# Altium project PA-HF_100W-VHF_60W.PrjPcb (part 1 of 2)
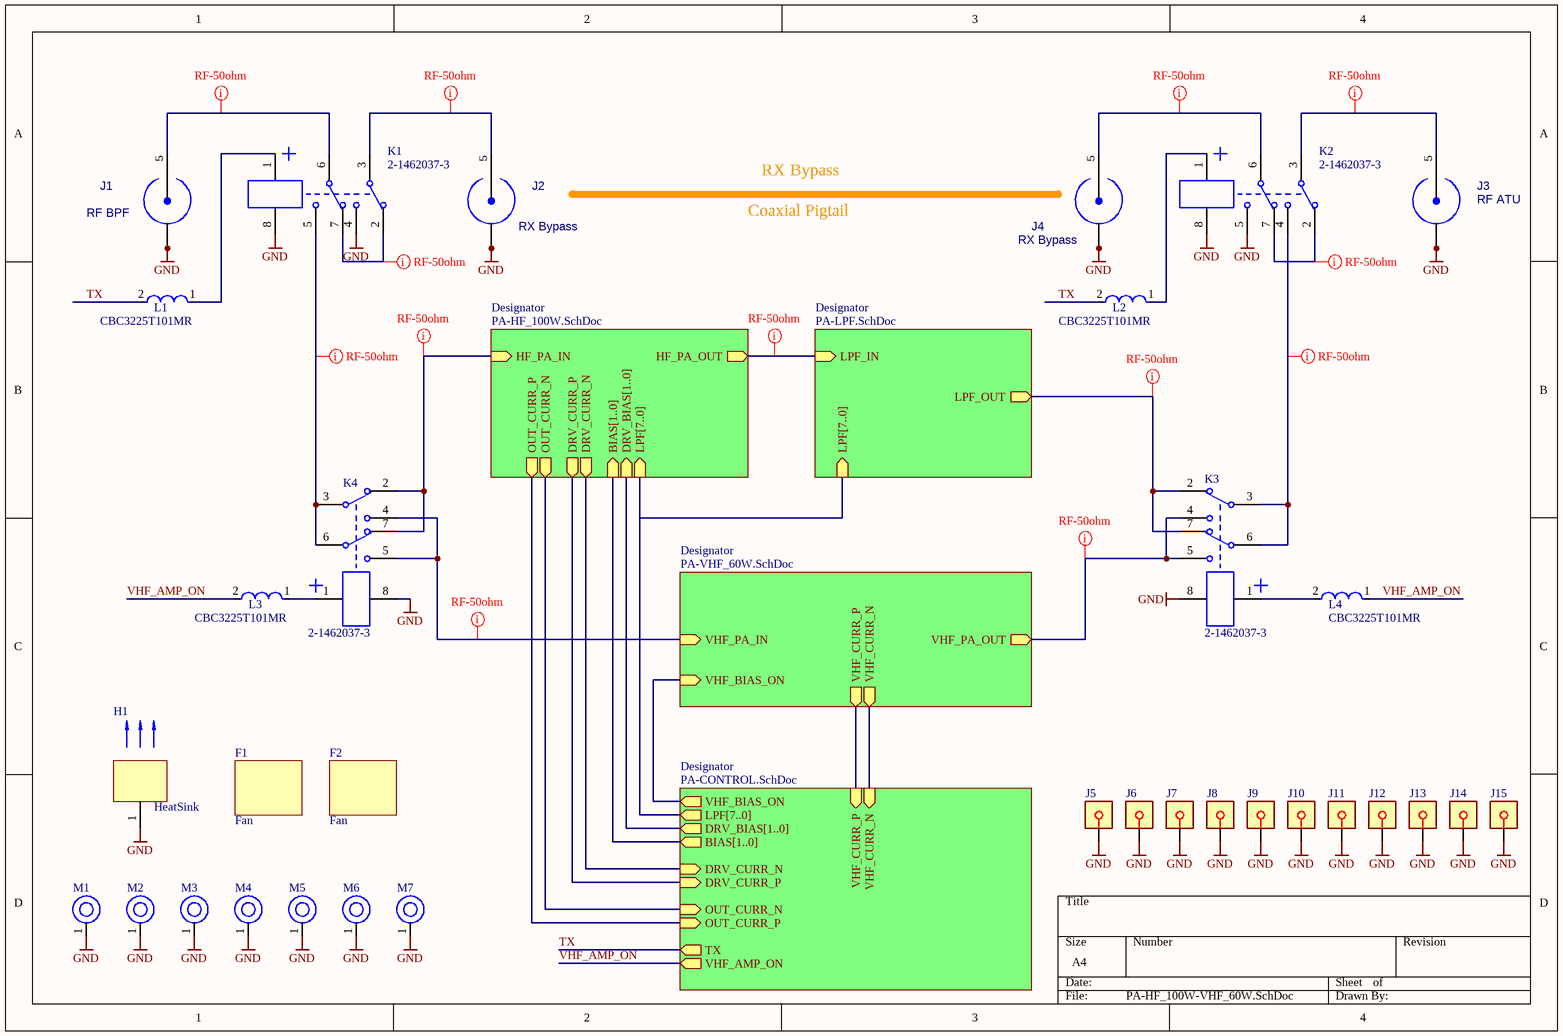
[diagram p0: PA-HF_100W-VHF_60W.SchDoc]
5 sheets, 427 parts. Net scope: hierarchical (ports join the sheet entries above them; power ports are global).
Board file: PA-HF_100W-VHF_60W.PcbDoc
Sheets:
  PA-HF_100W-VHF_60W.SchDoc
    Designator = PA-CONTROL.SchDoc
    Designator = PA-HF_100W.SchDoc
    Designator = PA-LPF.SchDoc
    Designator = PA-VHF_60W.SchDoc

## Sheet PA-HF_100W-VHF_60W.SchDoc
size A4; SheetNumber: 1; SheetTotal: 5

### Parts
F1  Fan  [Fan_60x60x25mm]
F2  Fan  [Fan_60x60x25mm]
H1  HeatSink  [HEATSINK_145x140x35]
J1  RF BPF  [31-5431]
J2  RX Bypass  [31-5431]
J3  RF ATU  [31-5431]
J4  RX Bypass  [31-5431]
J5  SMT RFI Shield Clip  [SMT RFI Shield Clip]  (value not drawn)
J6  SMT RFI Shield Clip  [SMT RFI Shield Clip]  (value not drawn)
J7  SMT RFI Shield Clip  [SMT RFI Shield Clip]  (value not drawn)
J8  SMT RFI Shield Clip  [SMT RFI Shield Clip]  (value not drawn)
J9  SMT RFI Shield Clip  [SMT RFI Shield Clip]  (value not drawn)
J10  SMT RFI Shield Clip  [SMT RFI Shield Clip]  (value not drawn)
J11  SMT RFI Shield Clip  [SMT RFI Shield Clip]  (value not drawn)
J12  SMT RFI Shield Clip  [SMT RFI Shield Clip]  (value not drawn)
J13  SMT RFI Shield Clip  [SMT RFI Shield Clip]  (value not drawn)
J14  SMT RFI Shield Clip  [SMT RFI Shield Clip]  (value not drawn)
J15  SMT RFI Shield Clip  [SMT RFI Shield Clip]  (value not drawn)
K1  2-1462037-3  [TECO-2-1462037-3_V]
K2  2-1462037-3  [TECO-2-1462037-3_V]
K3  2-1462037-3  [TECO-2-1462037-3_V]
K4  2-1462037-3  [TECO-2-1462037-3_V]
L1  CBC3225T101MR  [FP-CB3225-MFG]
L2  CBC3225T101MR  [FP-CB3225-MFG]
L3  CBC3225T101MR  [FP-CB3225-MFG]
L4  CBC3225T101MR  [FP-CB3225-MFG]
M1  MountHole  [MountHole]  (value not drawn)
M2  MountHole  [MountHole]  (value not drawn)
M3  MountHole  [MountHole]  (value not drawn)
M4  MountHole  [MountHole]  (value not drawn)
M5  MountHole  [MountHole]  (value not drawn)
M6  MountHole  [MountHole]  (value not drawn)
M7  MountHole  [MountHole]  (value not drawn)

### Sub-sheets
Designator = PA-CONTROL.SchDoc: LPF[7..0] (out), DRV_BIAS[1..0] (out), BIAS[1..0] (out), DRV_CURR_N (in), DRV_CURR_P (in), OUT_CURR_N (in), OUT_CURR_P (in), VHF_BIAS_ON (out), TX (out), VHF_AMP_ON (out), VHF_CURR_P (in), VHF_CURR_N (in)
Designator = PA-HF_100W.SchDoc: HF_PA_IN (in), HF_PA_OUT (out), DRV_BIAS[1..0] (in), BIAS[1..0] (in), DRV_CURR_N (out), DRV_CURR_P (out), OUT_CURR_N (out), OUT_CURR_P (out), LPF[7..0] (in)
Designator = PA-LPF.SchDoc: LPF_OUT (out), LPF_IN (in), LPF[7..0] (in)
Designator = PA-VHF_60W.SchDoc: VHF_PA_IN (in), VHF_PA_OUT (out), VHF_BIAS_ON (in), VHF_CURR_P (out), VHF_CURR_N (out)

### Nets
GND: H1.1 J1.1(GND) J1.2(GND) J1.3(GND) J1.4(GND) J2.1(GND) J2.2(GND) J2.3(GND) J2.4(GND) J3.1(GND) J3.2(GND) J3.3(GND) J3.4(GND) J4.1(GND) J4.2(GND) J4.3(GND) J4.4(GND) J5.1 J6.1 J7.1 J8.1 J9.1 J10.1 J11.1 J12.1 J13.1 J14.1 J15.1 K1.4 K1.8 K2.5 K2.8 K3.8 K4.8 M1.1 M2.1 M3.1 M4.1 M5.1 M6.1 M7.1
DRV_CURR_N: sheet Designator/DRV_CURR_N, sheet Designator/DRV_CURR_N
DRV_CURR_P: sheet Designator/DRV_CURR_P, sheet Designator/DRV_CURR_P
OUT_CURR_N: sheet Designator/OUT_CURR_N, sheet Designator/OUT_CURR_N
OUT_CURR_P: sheet Designator/OUT_CURR_P, sheet Designator/OUT_CURR_P
TX: L1.2 L2.2 ; sheet Designator/TX
VHF_AMP_ON: L3.2 L4.1 ; sheet Designator/VHF_AMP_ON
VHF_BIAS_ON: sheet Designator/VHF_BIAS_ON, sheet Designator/VHF_BIAS_ON
VHF_CURR_N: sheet Designator/VHF_CURR_N, sheet Designator/VHF_CURR_N
VHF_CURR_P: sheet Designator/VHF_CURR_P, sheet Designator/VHF_CURR_P
NetJ1_5: J1.5(CON) K1.6
NetJ2_5: J2.5(CON) K1.3
NetJ3_5: J3.5(CON) K2.3
NetJ4_5: J4.5(CON) K2.6
NetK1_1: K1.1 L1.1
NetK1_2: K1.2 K1.7
NetK1_5: K1.5 K4.3 K4.6
NetK2_1: K2.1 L2.1
NetK2_2: K2.2 K2.7
NetK2_4: K2.4 K3.3 K3.6
NetK3_1: K3.1 L4.2
NetK3_2: K3.2 K3.7 ; sheet Designator/LPF_OUT
NetK3_4: K3.4 K3.5 ; sheet Designator/VHF_PA_OUT
NetK4_1: K4.1 L3.1
NetK4_2: K4.2 K4.7 ; sheet Designator/HF_PA_IN
NetK4_4: K4.4 K4.5 ; sheet Designator/VHF_PA_IN
NetK6_4: sheet Designator/HF_PA_OUT, sheet Designator/LPF_IN

### Layout directives
rule Width Constraint [Pref Impedance = 50,00ohms    Min Impedance = 50,00ohms    Max Impedance = 50,00ohms]: NetJ1_5, NetJ2_5, NetJ3_5, NetJ4_5, NetK1_2, NetK1_5, NetK2_2, NetK2_4, NetK3_2, NetK3_4, NetK4_2, NetK4_4, NetK6_4

### Notes on the sheet
- RX Bypass
- Coaxial Pigtail

### Library data of the parts
J1-J4 = 31-5431: SMA
K1-K4 = CMP-2000-05409-1: Signal Relay, 2 A, 12 VDC, -40 to 85 degC, 8-Pin SMD, RoHS, Tape and Reel; Manufacturer: TE Connectivity; Coil Suppression Diode: No; Contact Arrangement: DPDT; Product Length (mm): 10mm; Product Height (mm): 5.65mm; Coil Voltage DC: 12V; Pick-up Voltage (Max): 9VDC; Coil Resistance: 1.029kohm; Voltage Rating (VDC): 220; Dropout Volt: 1.2VDC; Operate Time: 1ms; Contact Current Rating: 2A; Relay Construction: Non-Latching; Seal: Unsealed; Maximum Power Rating: 60W/62.5VA; Product Depth (mm): 7.5mm; Coil Current: 11.67mA; Voltage Rating (VAC): 250V; Contact Form: 2FormC; Contact Material: PalladiumRuthenium/Gold; Pin Count: 8; LED Indicator: No; Operating Temp Range: -40Cto85C; Push To Test Button: No; Mounting Style: SurfaceMount; Type: SignalRelay; Packaging: TapeandReel; Datasheet Version: Rev. 0116, 01/2016; Manufacturer URL: http://www.te.com/; Datasheet URL: http://www.te.com/commerce/DocumentDelivery/DDEController?Action=srchrtrv&DocNm=108-98001&DocType=SS&DocLang=EN; Termination Style: GullWing
L1-L4 = CMP-14484-000373-1: SMD Inductors 100uH ±20% 0.34A 1.82Ω 1210; Resistance: 1.4R; DC Current: 340mA; DC Resistance (DCR): 1.82R; Saturation Current: 270mA; Self Resonant Frequency: 6MHz; Core Material: Ferrite; Inductor Type: POWER; Shielding: Unshielded; Test Frequency: 100kHz; Max Operating Temperature: 105°C; Length: 0.126inch; Inductance: 100uH; Current Rating: 340mA; Resistor Type: Wirewound; Halogen Free: Halogen Free; Height - Seated (Max): 0.106inch; Case/Package: 1210; Package Quantity: 1000; Lead Free: Lead Free; Series: CB; Tolerance: 20%; Depth: 2.7mm; Number of Pins: 2; Width: 0.098inch; Termination: SMD/SMT; Min Operating Temperature: -40°C; Max DC Current: 340mA; Inductance Tolerance: 20%; Radiation Hardening: No; Military Standard: Not; Height: 2.5mm; Case Code (Metric): 3225; Packaging: Tape and Reel; Mount: Surface Mount; RoHS Compliant: Yes; Case Code (Imperial): 1210

## Sheet PA-CONTROL.SchDoc
size A3; SheetNumber: 5; SheetTotal: 5
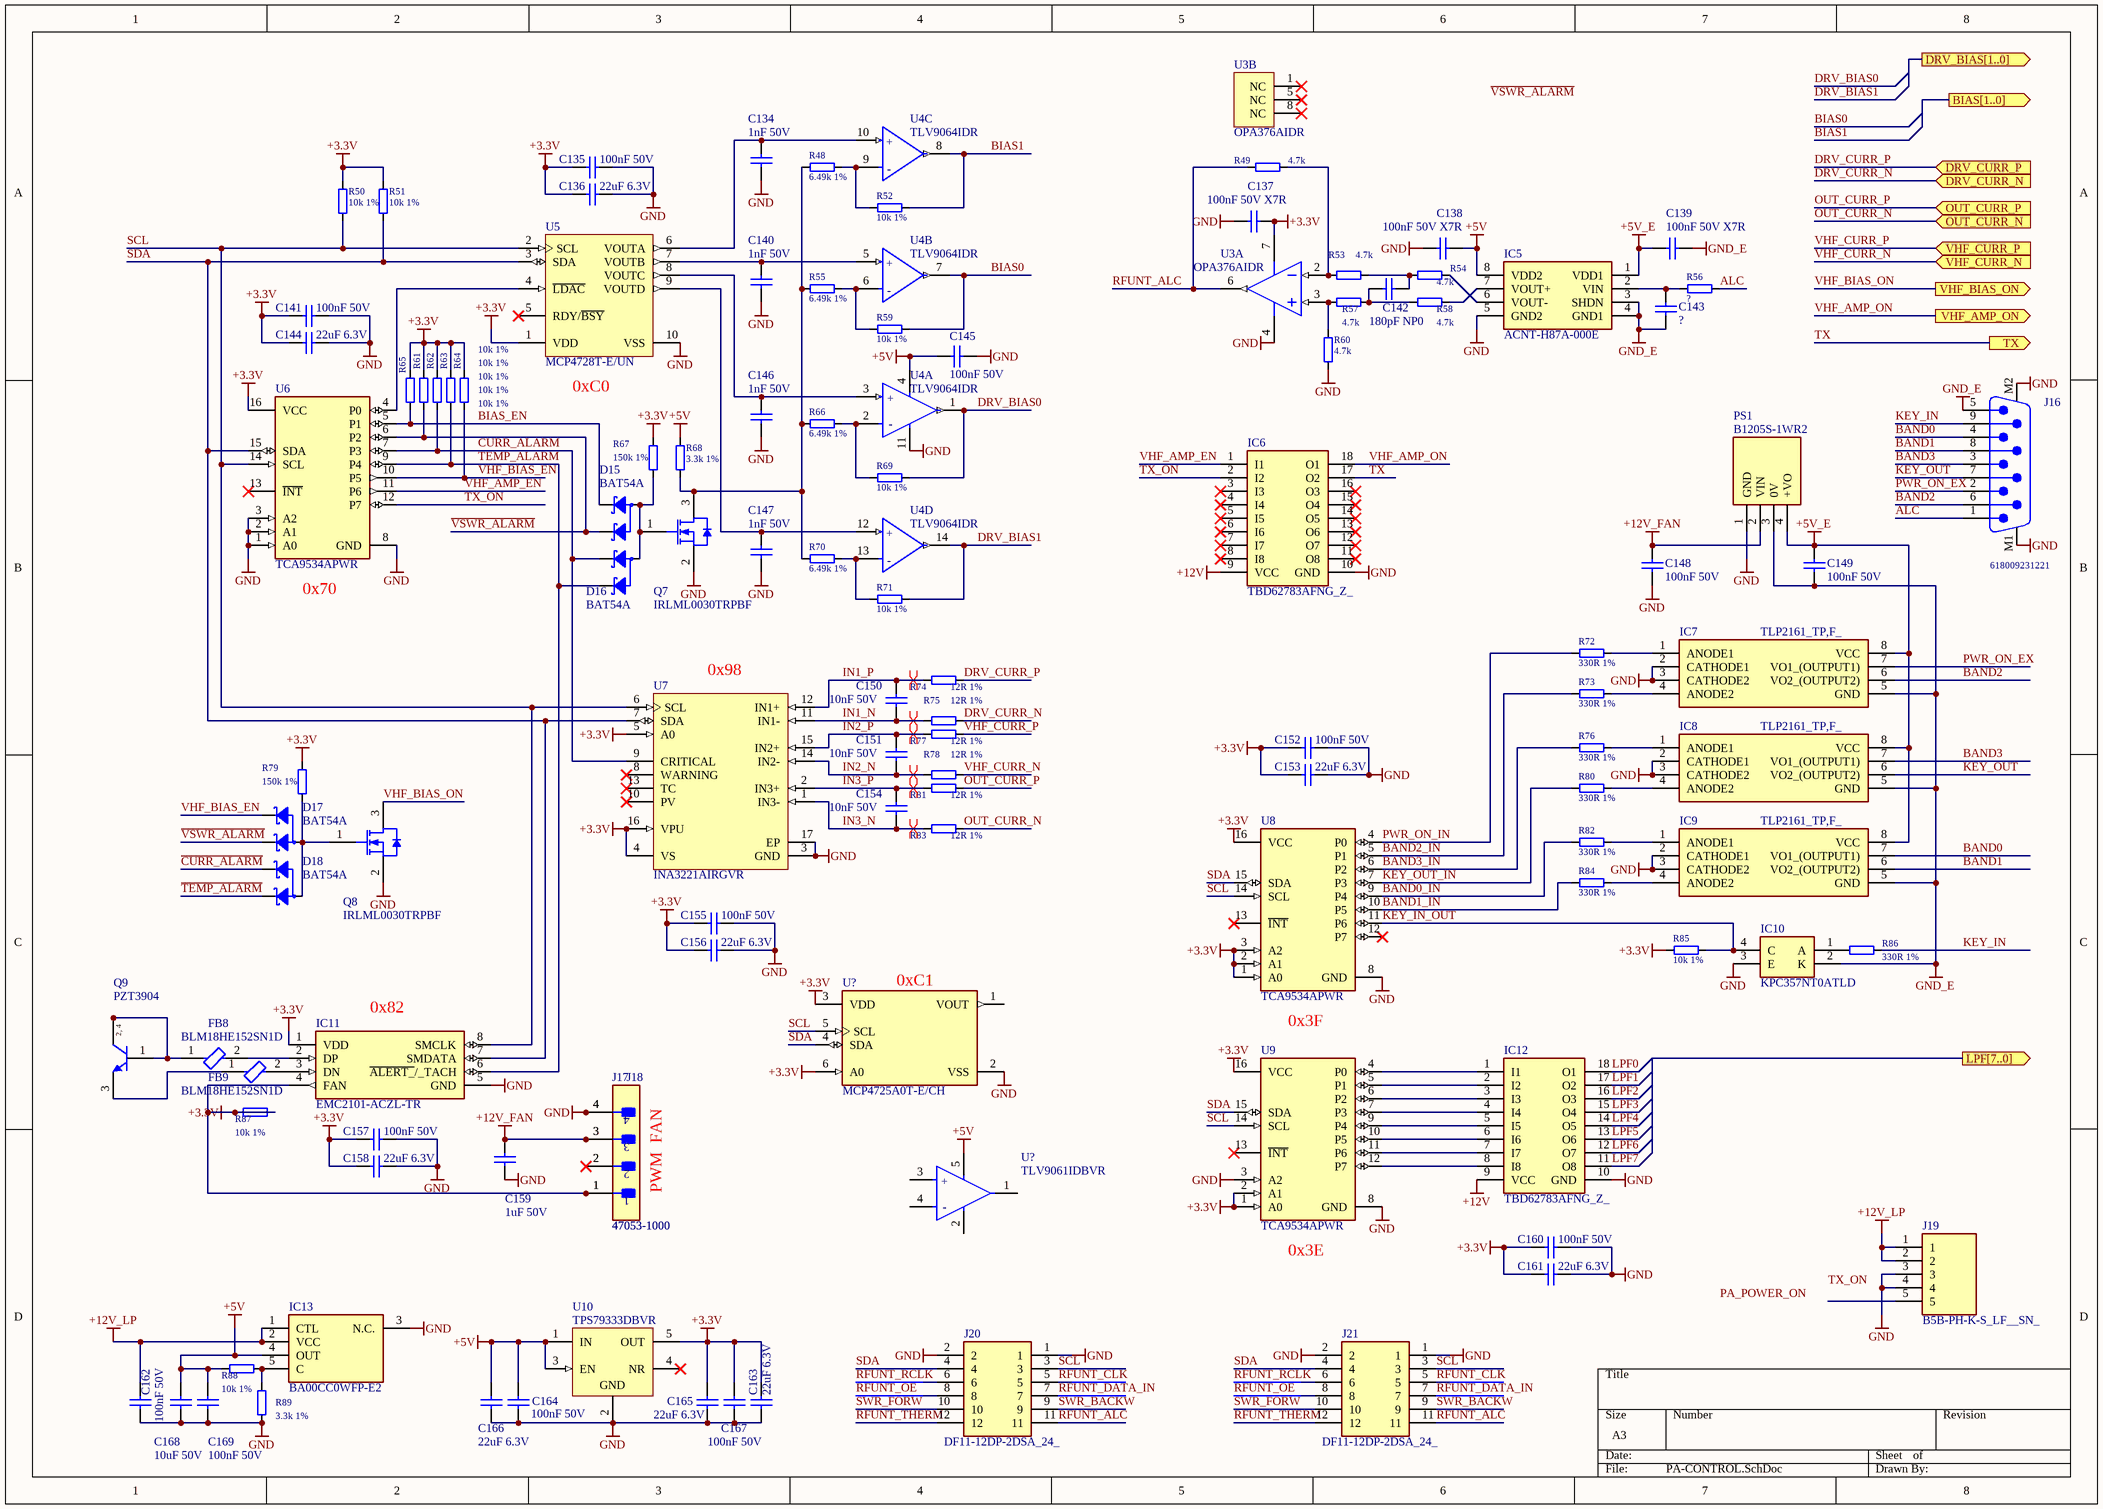
[diagram p1: PA-CONTROL.SchDoc]

### Parts
(Parts that share a designator on the sheet are numbered #1, #2 ... from top to bottom, then left to right.)
C134  1nF 50V  [C-0805]
C135  100nF 50V  [C-0805]
C136  22uF 6.3V  [C-0805]
C137  100nF 50V X7R  [C-0805]
C138  100nF 50V X7R  [C-0805]
C139  100nF 50V X7R  [C-0805]
C140  1nF 50V  [C-0805]
C141  100nF 50V  [C-0805]
C142  180pF NP0  [C-0805]
C143  ?  [C-0805]
C144  22uF 6.3V  [C-0805]
C145  100nF 50V  [C-0805]
C146  1nF 50V  [C-0805]
C147  1nF 50V  [C-0805]
C148  100nF 50V  [C-0805]
C149  100nF 50V  [C-0805]
C150  10nF 50V  [C-0805]
C151  10nF 50V  [C-0805]
C152  100nF 50V  [C-0805]
C153  22uF 6.3V  [C-0805]
C154  10nF 50V  [C-0805]
C155  100nF 50V  [C-0805]
C156  22uF 6.3V  [C-0805]
C157  100nF 50V  [C-0805]
C158  22uF 6.3V  [C-0805]
C159  1uF 50V  [C-0805]
C160  100nF 50V  [C-0805]
C161  22uF 6.3V  [C-0805]
C162  100nF 50V  [C-0805]
C163  22uF 6.3V  [C-0805]
C164  100nF 50V  [C-0805]
C165  22uF 6.3V  [C-0805]
C166  22uF 6.3V  [C-0805]
C167  100nF 50V  [C-0805]
C168  10uF 50V  [C-0805]
C169  100nF 50V  [C-0805]
D15  BAT54A  [SOT-23]
D16  BAT54A  [SOT-23]
D17  BAT54A  [SOT-23]
D18  BAT54A  [SOT-23]
FB8  BLM18HE152SN1D  [FP-BLM18-0_15-t0_8-IPC_C]
FB9  BLM18HE152SN1D  [FP-BLM18-0_15-t0_8-IPC_C]
IC5  ACNT-H87A-000E  [SOIC127P1661X403-8N]
IC6  TBD62783AFNG_Z_  [SOP65P640X155-18N]
IC7  TLP2161_TP,F_  [SOIC127P600X290-8N]
IC8  TLP2161_TP,F_  [SOIC127P600X290-8N]
IC9  TLP2161_TP,F_  [SOIC127P600X290-8N]
IC10  KPC357NT0ATLD  [KPC357NT0ATLD]
IC11  EMC2101-ACZL-TR  [SOP65P490X110-8N]
IC12  TBD62783AFNG_Z_  [SOP65P640X155-18N]
IC13  BA00CC0WFP-E2  [BA00CC0WFPE2]
J16  618009231221  [618009231221]
J17  47053-1000  [FP-47053-1000-MFG]
J18  47053-1000  [FP-47053-1000-MFG]
J19  B5B-PH-K-S_LF__SN_  [SHDR5W50P0X200_1X5_1190X450X600P]
J20  DF11-12DP-2DSA_24_  [SHDR12W60P200_2X6_1400X500X690P]
J21  DF11-12DP-2DSA_24_  [SHDR12W60P200_2X6_1400X500X690P]
PS1  B1205S-1WR2  [B1205S1WR2]
Q7  IRLML0030TRPBF  [INTR-SOT-23-3_V]
Q8  IRLML0030TRPBF  [INTR-SOT-23-3_V]
Q9  PZT3904  [FAIR-SOT223-4_V]
R48  6.49k 1%  [R-0805]
R49  4.7k  [R-0805]
R50  10k 1%  [R-0805]
R51  10k 1%  [R-0805]
R52  10k 1%  [R-0805]
R53  4.7k  [R-0805]
R54  4.7k  [R-0805]
R55  6.49k 1%  [R-0805]
R56  ?  [R-0805]
R57  4.7k  [R-0805]
R58  4.7k  [R-0805]
R59  10k 1%  [R-0805]
R60  4.7k  [R-0805]
R61  10k 1%  [R-0805]
R62  10k 1%  [R-0805]
R63  10k 1%  [R-0805]
R64  10k 1%  [R-0805]
R65  10k 1%  [R-0805]
R66  6.49k 1%  [R-0805]
R67  150k 1%  [R-0805]
R68  3.3k 1%  [R-0805]
R69  10k 1%  [R-0805]
R70  6.49k 1%  [R-0805]
R71  10k 1%  [R-0805]
R72  330R 1%  [R-0805]
R73  330R 1%  [R-0805]
R74  12R 1%  [R-0805]
R75  12R 1%  [R-0805]
R76  330R 1%  [R-0805]
R77  12R 1%  [R-0805]
R78  12R 1%  [R-0805]
R79  150k 1%  [R-0805]
R80  330R 1%  [R-0805]
R81  12R 1%  [R-0805]
R82  330R 1%  [R-0805]
R83  12R 1%  [R-0805]
R84  330R 1%  [R-0805]
R85  10k 1%  [R-0805]
R86  330R 1%  [R-0805]
R87  10k 1%  [R-0805]
R88  10k 1%  [R-0805]
R89  3.3k 1%  [R-0805]
U3  OPA376AIDR  [D0008A_N]  (parts A,B of 2)
U4  TLV9064IDR  [FP-D0014A-MFG]  (parts A,B,C,D of 4)
U5  MCP4728T-E/UN  [MSOP-UN10_L]
U6  TCA9534APWR  [FP-PW0016A-MFG]
U7  INA3221AIRGVR  [RGV0016A_V]
U8  TCA9534APWR  [FP-PW0016A-MFG]
U9  TCA9534APWR  [FP-PW0016A-MFG]
U10  TPS79333DBVR  [DBV0005A_L]
U?#1  MCP4725A0T-E/CH  [FP-C04-028-CHY-MFG]
U?#2  TLV9061IDBVR  [FP-DBV0005A-MFG]

### Ports
BIAS[1..0] (out), DRV_BIAS[1..0] (out), DRV_CURR_N (in), DRV_CURR_P (in), LPF[7..0] (out), OUT_CURR_N (in), OUT_CURR_P (in), TX (out), VHF_AMP_ON (out), VHF_BIAS_ON (out), VHF_CURR_N (in), VHF_CURR_P (in)

### Nets
+3.3V: C135.2 C136.2 C137.2 C141.2 C144.2 C152.2 C153.2 C155.2 C156.2 C157.2 C158.2 C160.2 C161.2 C163.2 C165.2 C167.2 IC11.1(VDD) IC11.4(FAN) J17.1 J18.1 R50.1 R51.1 R61.1 R62.1 R63.1 R64.1 R65.1 R67.1 R79.1 R85.2 R87.1 R87.2 U3.7(V+) U5.1(VDD) U6.16(VCC) U7.4(VS) U7.5(A0) U7.16(VPU) U8.1(A0) U8.2(A1) U8.3(A2) U8.16(VCC) U9.1(A0) U9.2(A1) U9.16(VCC) U10.5(OUT) U?#1.3(VDD) U?#1.6(A0)
+5V: C138.2 C145.2 C164.2 C166.2 C168.2 C169.2 IC5.8(VDD2) IC13.4(OUT) R68.1 R88.2 U4.4(V+) U10.1(IN) U10.3(EN) U?#2.5(V+)
+5V_E: C139.1 C149.1 IC5.1(VDD1) IC7.8(VCC) IC8.8(VCC) IC9.8(VCC) PS1.4(+VO)
+12V: IC6.9(VCC) IC12.9(VCC)
+12V_FAN: C148.1 C159.2 J17.3 J18.3 PS1.2(VIN)
+12V_LP: C162.2 IC13.1(CTL) IC13.2(VCC) J19.1 J19.2
GND: C134.1 C135.1 C136.1 C137.1 C138.1 C140.1 C141.1 C144.1 C145.1 C146.1 C147.1 C148.2 C152.1 C153.1 C155.1 C156.1 C157.1 C158.1 C159.1 C160.1 C161.1 C162.1 C163.1 C164.1 C165.1 C166.1 C167.1 C168.1 C169.1 IC5.5(GND2) IC6.10(GND) IC7.2(CATHODE1) IC7.3(CATHODE2) IC8.2(CATHODE1) IC8.3(CATHODE2) IC9.2(CATHODE1) IC9.3(CATHODE2) IC10.3(E) IC11.5(GND) IC12.10(GND) IC13.3(N.C.) J16.M1 J16.M2 J17.4 J18.4 J19.3 J19.4 J20.1 J20.2 J21.1 J21.2 PS1.1(GND) Q7.2(S) Q8.2(S) R60.2 R89.2 U3.4(V-) U4.11(V-) U5.10(VSS) U6.1(A0) U6.2(A1) U6.3(A2) U6.8(GND) U7.3(GND) U7.17(EP) U8.8(GND) U9.3(A2) U9.8(GND) U10.2(GND) U?#1.2(VSS)
GND_E: C139.2 C143.2 C149.2 IC5.3(SHDN) IC5.4(GND1) IC7.5(GND) IC8.5(GND) IC9.5(GND) IC10.2(K) J16.5 PS1.3(0V)
ALC: J16.1 R56.1
BAND0: IC9.7(VO1_(OUTPUT1)) J16.4
BAND0_IN: R82.2 U8.9(P4)
BAND1: IC9.6(VO2_(OUTPUT2)) J16.8
BAND1_IN: R84.2 U8.10(P5)
BAND2: IC7.6(VO2_(OUTPUT2)) J16.6
BAND2_IN: R73.2 U8.5(P1)
BAND3: IC8.7(VO1_(OUTPUT1)) J16.3
BAND3_IN: R76.2 U8.6(P2)
BIAS0: R59.1 U4.7(OUT2)
BIAS1: R52.1 U4.8(OUT3)
BIAS_EN: D15.1 R65.2 U6.5(P1)
~{CURR_ALARM}: D16.1 D18.2 R62.2 U6.7(P3) U7.9(CRITICAL)
DRV_BIAS0: R69.1 U4.1(OUT1)
DRV_BIAS1: R71.1 U4.14(OUT4)
DRV_CURR_N: R75.1 ; port DRV_CURR_N
DRV_CURR_P: R74.1 ; port DRV_CURR_P
IN1_N: C150.1 R75.2 U7.11(IN1-)
IN1_P: C150.2 R74.2 U7.12(IN1+)
IN2_N: C151.1 R78.2 U7.14(IN2-)
IN2_P: C151.2 R77.2 U7.15(IN2+)
IN3_N: C154.1 R83.2 U7.1(IN3-)
IN3_P: C154.2 R81.2 U7.2(IN3+)
KEY_IN: J16.9 R86.1
KEY_IN_OUT: IC10.4(C) R85.1 U8.11(P6)
KEY_OUT: IC8.6(VO2_(OUTPUT2)) J16.7
KEY_OUT_IN: R80.2 U8.7(P3)
LPF0: IC12.18(O1)
LPF1: IC12.17(O2)
LPF2: IC12.16(O3)
LPF3: IC12.15(O4)
LPF4: IC12.14(O5)
LPF5: IC12.13(O6)
LPF6: IC12.12(O7)
LPF7: IC12.11(O8)
OUT_CURR_N: R83.1 ; port OUT_CURR_N
OUT_CURR_P: R81.1 ; port OUT_CURR_P
PWR_ON_EX: IC7.7(VO1_(OUTPUT1)) J16.2
PWR_ON_IN: R72.2 U8.4(P0)
RFUNT_ALC: J20.11 J21.11 R49.2 U3.6(OUT)
RFUNT_CLK: J20.5 J21.5
RFUNT_DATA_IN: J20.7 J21.7
RFUNT_OE: J20.8 J21.8
RFUNT_RCLK: J20.6 J21.6
RFUNT_THERM: J20.12 J21.12
SCL: IC11.8(SMCLK) J20.3 J21.3 R50.2 U5.2(SCL) U6.14(SCL) U7.6(SCL) U8.14(SCL) U9.14(SCL) U?#1.5(SCL)
SDA: IC11.7(SMDATA) J20.4 J21.4 R51.2 U5.3(SDA) U6.15(SDA) U7.7(SDA) U8.15(SDA) U9.15(SDA) U?#1.4(SDA)
SWR_BACKW: J20.9 J21.9
SWR_FORW: J20.10 J21.10
~{TEMP_ALARM}: D16.2 D18.1 IC11.6(~{ALERT_}/_TACH) R63.2 U6.9(P4)
TX: IC6.17(O2) ; port TX
TX_ON: IC6.2(I2) U6.12(P7)
~{VSWR_ALARM}: D15.2 D17.1 R61.2 U6.6(P2)
VHF_AMP_EN: IC6.1(I1) U6.11(P6)
VHF_AMP_ON: IC6.18(O1) ; port VHF_AMP_ON
VHF_BIAS_EN: D17.2 R64.2 U6.10(P5)
VHF_BIAS_ON: Q8.3(D) ; port VHF_BIAS_ON
VHF_CURR_N: R78.1 ; port VHF_CURR_N
VHF_CURR_P: R77.1 ; port VHF_CURR_P
NetC134_2: C134.2 U4.10(IN3+) U5.6(VOUTA)
NetC140_2: C140.2 U4.5(IN2+) U5.7(VOUTB)
NetC142_1: C142.1 R57.1 R58.2
NetC142_2: C142.2 R53.1 R54.2
NetC143_1: C143.1 IC5.2(VIN) R56.2
NetC146_2: C146.2 U4.3(IN1+) U5.8(VOUTC)
NetC147_2: C147.2 U4.12(IN4+) U5.9(VOUTD)
NetD15_3: D15.3 D16.3 Q7.1(G) R67.2
NetD17_3: D17.3 D18.3 Q8.1(G) R79.2
NetFB8_1: FB8.1 Q9.1(B) Q9.2(C) Q9.4(C)
NetFB8_2: FB8.2 IC11.2(DP)
NetFB9_1: FB9.1 Q9.3(E)
NetFB9_2: FB9.2 IC11.3(DN)
NetIC5_6: IC5.6(VOUT-) R54.1
NetIC5_7: IC5.7(VOUT+) R58.1
NetIC7_1: IC7.1(ANODE1) R72.1
NetIC7_4: IC7.4(ANODE2) R73.1
NetIC8_1: IC8.1(ANODE1) R76.1
NetIC8_4: IC8.4(ANODE2) R80.1
NetIC9_1: IC9.1(ANODE1) R82.1
NetIC9_4: IC9.4(ANODE2) R84.1
NetIC10_1: IC10.1(A) R86.2
NetIC12_1: IC12.1(I1) U9.4(P0)
NetIC12_2: IC12.2(I2) U9.5(P1)
NetIC12_3: IC12.3(I3) U9.6(P2)
NetIC12_4: IC12.4(I4) U9.7(P3)
NetIC12_5: IC12.5(I5) U9.9(P4)
NetIC12_6: IC12.6(I6) U9.10(P5)
NetIC12_7: IC12.7(I7) U9.11(P6)
NetIC12_8: IC12.8(I8) U9.12(P7)
NetIC13_5: IC13.5(C) R88.1 R89.1
NetJ17_2: J17.2 J18.2
NetQ7_3: Q7.3(D) R48.2 R55.2 R66.2 R68.2 R70.2
NetR48_1: R48.1 R52.2 U4.9(IN3-)
NetR49_1: R49.1 R53.2 U3.2(IN-)
NetR55_1: R55.1 R59.2 U4.6(IN2-)
NetR57_2: R57.2 R60.1 U3.3(IN+)
NetR66_1: R66.1 R69.2 U4.2(IN1-)
NetR70_1: R70.1 R71.2 U4.13(IN4-)
NetU5_4: U5.4(~{LDAC}) U6.4(P0)

Not connected (* = marked no-connect by the designer): IC6 3(I3)* 4(I4)* 5(I5)* 6(I6)* 7(I7)* 8(I8)* 11(O8)* 12(O7)* 13(O6)* 14(O5)* 15(O4)* 16(O3)*; J19 5; U3 1(NC)* 5(NC)* 8(NC)*; U5 5(RDY/~{BSY})*; U6 13(~{INT})*; U7 8(WARNING)* 10(PV)* 13(TC)*; U8 12(P7)* 13(~{INT})*; U9 13(~{INT})*; U10 4(NR)*; U?#1 1(VOUT); U?#2 1(OUT) 2(V-) 3(IN+) 4(IN-)

### Layout directives
differential pair: IN1_N, IN1_P, IN2_N, IN2_P, IN3_N, IN3_P

### Notes on the sheet
- (near U5) 0xC0
- (near U6) 0x70
- (near U7) 0x98
- (near U?#1) 0xC1
- (near IC11) 0x82
- 0x3F
- PWM  FAN
- (near U9) 0x3E
- Labels drawn without touching a wire or pin: PA_POWER_ON, TX_ON, ~{VSWR_ALARM}
- (in symbol CMP-2000-06916-1) 2, 4
- (in symbol CMP-04895-000189-1, part A) +; -
- (in symbol CMP-04895-000189-1, part B) +; -
- (in symbol CMP-04895-000189-1, part C) +; -
- (in symbol CMP-04895-000189-1, part D) +; -
- (in symbol CMP-04895-000218-1) +; -

### Library data of the parts
C134-C169 = C semi: Ceramic Multilayer Capacitor
FB8 FB9 = CMP-0686-00368-3: Chip Ferrite Bead, 0603, 1500Ω @ 100MHz, 0.5Ω, 25%, 500mA; Impedance: 1.5kR; DC Resistance (DCR): 500mR; Number of Circuits: 1; Test Frequency: 100MHz; Case/Package: 0603; Max Operating Temperature: 125°C; Package Quantity: 1; Max DC Current: 500mA; Tolerance: 25%; Core Material: Ferrite; Width: 0.8mm; Number of Pins: 2; Depth: 0.8mm; Radiation Hardening: No; Case Code (Imperial): 0603; Min Operating Temperature: -55°C; Termination: SMD/SMT; Material: Ferrite; Military Standard: Not; Number of Lines: 1; DC Current: 500mA; Length: 1.6mm; REACH SVHC: No SVHC; Lead Free: Lead Free; Current Rating: 500mA; Max Current Rating: 500mA; Packaging: Tape and Reel; Case Code (Metric): 1608; Height: 0.8mm
IC5 = ACNT-H87A-000E: Integrated Circuit; Manufacturer_Name: Avago Technologies; Datasheet Link: https://4donline.ihs.com/images/VipMasterIC/IC/AVGO/AVGO-S-A0003550281/AVGO-S-A0003550281-1.pdf?hkey=52A5661711E402568146F3353EA87419; Height: 4.034mm; Manufacturer_Part_Number: ACNT-H87A-000E; Mouser Part Number: 630-ACNT-H87A-000E; Mouser Price/Stock: https://www.mouser.co.uk/ProductDetail/Broadcom-Avago/ACNT-H87A-000E?qs=BZBei1rCqCBJ1okFPm4nfQ%3D%3D
IC6 IC12 = TBD62783AFNG_Z_: Integrated Circuit; Manufacturer_Name: Toshiba; Manufacturer_Part_Number: TBD62783AFNG(Z); Datasheet Link: https://toshiba.semicon-storage.com/info/docget.jsp?did=30523; Height: 1.55mm
IC7-IC9 = TLP2160_TP,F_: Integrated Circuit; Manufacturer_Name: Toshiba; Manufacturer_Part_Number: TLP2160(TP,F); Datasheet Link: https://toshiba.semicon-storage.com/info/docget.jsp?did=10044&prodName=TLP2160; Height: 2.9mm; Mouser Part Number: 757-TLP2160TPF; Mouser Price/Stock: https://www.mouser.co.uk/ProductDetail/Toshiba/TLP2160TPF?qs=BybUIy1AcUYH5UC919f%2FeA%3D%3D; Arrow Part Number: TLP2160(TP,F); Arrow Price/Stock: https://www.arrow.com/en/products/tlp2160-tpf/toshiba
IC10 = KPC357NT0ATLD: Integrated Circuit; Manufacturer_Name: Cosmo Electronics; Datasheet Link: https://datasheet.lcsc.com/szlcsc/Cosmo-Electronics-KPC357NT0ATLD_C136410.pdf; Height: 2.7mm; Manufacturer_Part_Number: KPC357NT0ATLD
IC11 = EMC2101-ACZL-TR: Integrated Circuit; Manufacturer_Name: Microchip; Datasheet Link: http://ww1.microchip.com/downloads/en/DeviceDoc/2101.pdf; Height: 1.1mm; Manufacturer_Part_Number: EMC2101-ACZL-TR; Mouser Part Number: 886-EMC2101-ACZL-TR; Mouser Price/Stock: https://www.mouser.co.uk/ProductDetail/Microchip-Technology/EMC2101-ACZL-TR?qs=pA5MXup5wxFIE%2FN8LSbs9g%3D%3D; Arrow Part Number: EMC2101-ACZL-TR; Arrow Price/Stock: https://www.arrow.com/en/products/emc2101-aczl-tr/microchip-technology
IC13 = BA00CC0WFP-E2: Integrated Circuit; Manufacturer_Name: ROHM Semiconductor; Datasheet Link: https://datasheet.datasheetarchive.com/originals/dk/DKDS-10/186347.pdf; Height: 2.5mm; Manufacturer_Part_Number: BA00CC0WFP-E2; Mouser Part Number: 755-BA00CC0WFP-E2; Mouser Price/Stock: https://www.mouser.co.uk/ProductDetail/ROHM-Semiconductor/BA00CC0WFP-E2?qs=4kLU8WoGk0t%2Fg3HZY45H1w%3D%3D; Arrow Part Number: BA00CC0WFP-E2; Arrow Price/Stock: https://www.arrow.com/en/products/ba00cc0wfp-e2/rohm-semiconductor
J16 = CMP-1502-00284-1: Male PCB Connector with Hex Screw WR-DSUB, 8.08 mm, Angled, 9 pins; Manufacturer: Wurth Elektronik; Working Voltage: 125VAC; Contact Resistance: 30mOhm; Rated Current: 3A; Pin Number: 9; Manufacturer URL: http://www.we-online.de; Orientation: Angled; Operating Temperature: -40to85degC; Package Reference: 618009231221; Gender: Male; Mounting Technology: THT; Publisher: WurthElektronik; Datasheet URL: https://katalog.we-online.de/em/datasheet/6180xx231221.pdf; Part Number: 618009231221; Packaging: Tray
J17 J18 = CMP-04776-000290-1: CONN HEADER VERT 4POS 2.54MM; Number of Positions: 4; Voltage Rating (DC): 250V; Gender: Male; Current Rating: 4A; Glow Wire Compliant: Non-compliant; Contact Material: Brass; Contact Plating: Tin; Radiation Hardening: No; Package Quantity: 12000; Packaging: Bulk; Termination: Through Hole; Depth: 5.84mm; Series: 47053; Number of Contacts: 4; Length: 10.2mm; Halogen Free: Low Halogen; Number of Circuits: 4; Max Operating Temperature: 75°C; Housing Color: Beige; Min Operating Temperature: 0°C; Number of Rows: 1; Pitch: 2.54mm; Housing Material: Nylon; Orientation: Vertical; Mount: Through Hole; Voltage Rating: 250V
J19 = B5B-PH-K-S_LF__SN_: Connector; Manufacturer_Name: JST (JAPAN SOLDERLESS TERMINALS); Manufacturer_Part_Number: B5B-PH-K-S(LF)(SN); Datasheet Link: http://uk.rs-online.com/web/p/products/8201438; Height: 6mm; Arrow Part Number: B5B-PH-K-S(LF)(SN); Arrow Price/Stock: https://www.arrow.com/en/products/b5b-ph-k-s-lf-sn/jst-manufacturing
J20 J21 = DF11-12DP-2DSA_24_: Connector; Manufacturer_Name: Hirose; Manufacturer_Part_Number: DF11-12DP-2DSA(24); Datasheet Link: https://datasheet.datasheetarchive.com/originals/distributors/SFDatasheet-7/sf-000141225.pdf; Height: 6.9mm; Mouser Part Number: 798-DF11-12DP-2DSA24; Mouser Price/Stock: https://www.mouser.co.uk/ProductDetail/Hirose-Connector/DF11-12DP-2DSA24?qs=zOgoZG1CgI9hGIQfeQgy6Q%3D%3D; Arrow Part Number: DF11-12DP-2DSA(24); Arrow Price/Stock: https://www.arrow.com/en/products/df11-12dp-2dsa-24/hirose-electric
PS1 = B1205S-1WR2: Power Supply; Manufacturer_Name: Mornsun; Datasheet Link: https://www.mornsun-power.com/public/uploads/pdf/B_D-1WR2.pdf; Height: 10.41mm; Manufacturer_Part_Number: B1205S-1WR2
Q7 Q8 = CMP-2000-06483-1: HEXFET(R) Power MOSFET, 1.3 W, 4.4 ns, -55 to 150 degC, 3-Pin SOT-23, RoHS, Tape and Reel; Manufacturer: International Rectifier; Maximum Drain Source Resistance: 0.027Ω; Transistor Configuration: Single; Channel Mode: Enhancement; Maximum Power Dissipation: 1.3W; Typical Input Capacitance @ Vds: 382pF@15V; Maximum Gate Source Voltage: ±20V; Number of Elements per Chip: 1; Transistor Material: Si; Maximum Gate Threshold Voltage: 2.3V; Typical Turn-On Delay Time: 5.2ns; Maximum Drain Source Voltage: 30V; Typical Turn-Off Delay Time: 7.4ns; Minimum Gate Threshold Voltage: 1.3V; Channel Type: N; Typical Gate Charge @ Vgs: 2.6nC@4.5V; Maximum Continuous Drain Current: 5.3A; Pin Count: 3; Mounting Technology: SurfaceMount; Datasheet URL: https://datasheet.ciiva.com/4442/irlml0030pbf-90019-4442451.pdf; Datasheet Version: 02/2012; Maximum Operating Temperature: +150°C; Category: PowerMOSFET; Package Description: 3-Pin Small Outline Transistor, Body 2.92 x 1.3 mm, Pitch 0.95 mm; Manufacturer URL: http://internationalrectifier.com/; Height: 1.02mm; Minimum Operating Temperature: -55°C; Dimensions: 3.04x1.4x1.02mm; Package Reference: SOT-23-3; Package Type: SOT-23; Mounting Type: SurfaceMount; Length: 3.04mm; Width: 1.4mm
Q9 = CMP-2000-06916-1: NPN General-Purpose Amplifier, 40 V, 200 mA, -55 to 150 degC, 4-Pin SOT223, RoHS, Tape and Reel; Manufacturer: FairchildSemiconductor; Maximum Collector Emitter Saturation Voltage: 0.2@1mA@10mA; Package Version: Rev. 3, 07/2016; Rad Hard: No; Minimum DC Current Gain: 40@0.1mA@1V; Maximum DC Collector Current: 0.2A; Maximum Collector Base Voltage: 60V; Maximum Operating Frequency: 300(Min)MHz; Maximum Power Dissipation: 1000mW; Maximum Collector Emitter Voltage: 40V; Manufacturer URL: https://www.fairchildsemi.com/; Package URL: https://www.fairchildsemi.com.cn/package-drawings/MA/MA04A.pdf; Mounting Technology: SurfaceMount; Mounting: SurfaceMount; Datasheet URL: https://www.fairchildsemi.com/datasheets/MM/MMBT3904.pdf; Operating Temperature: -55to150°C; Package Description: 4-Pin Small Outline Transistor, Body 6.45 x 3.5 mm, Pitch 2.3 mm; Datasheet Version: Rev. 1.1.0, 10/2014; Packaging: Tape&Reel; Package Reference: SOT223-4; Package: 4SOT-223; Category: GPBJT; Type: NPN; Pin Count: 4
R48-R89 = RES semi: Chip Resistor; Power: *; TCR: *; Series: *; Tolerance: *
U3 = CMP-0272-00694-3: Precision, Low Noise, Low Iq Operational Amplifier, 2.2 to 5.5 V, -40 to 125 degC, 8-pin SOIC (D8), Green (RoHS & no Sb/Br); Manufacturer: Texas Instruments; Vio (25C)(Max)(mV): 0.025; Number of Channels: 1; Sub Family: Low Input Bias Current Amp (<=10pA), Low Noise Amp (<=10nV/rtHz), Low Offset Voltage Amplifier (<=500uV), Low Supply Voltage Amplifier (<=2.7V), Precision Amplifier; Offset Drift(Typ)(uV/C): 0.32; Total Supply Voltage(Max)(+5V is 5, +/-5V is 10): 5.5; Vn at 1kHz(Typ)(nV/rtHz): 7.5; IIB(Max)(pA): 10; CMRR(Min)(dB): 76; Iq per channel(Max)(mA): 0.95; Total Supply Voltage(Min)(+5V is 5, +/-5V is 10): 2.2; Slew Rate(Typ)(V/us): 2; ComponentLink3URL: http://www.ti.com/litv/pdf/msoi002j; ComponentLink3Description: Package Specification; ComponentLink1Description: Manufacturer URL; Eco-Plan: Green (RoHS & no Sb/Br); DatasheetVersion: SBOS406F; PackageVersion: 4040047-3/M, 06/2011; ComponentLink1URL: http://www.ti.com/; PackageDescription: 8-Pin Plastic Small Outline, Body 4.9 x 3.9 mm, Pitch 1.27 mm; ComponentLink2Description: Datasheet; PackageReference: D0008A; PartNumber: OPA376AIDR; Mounting Technology: Surface Mount; ComponentLink2URL: http://www.ti.com/general/docs/lit/getliterature.tsp?genericPartNumber=OPA376&fileType=pdf; Code_JEDEC: MS-012
U4 = CMP-04895-000189-1: IC CMOS 4 CIRCUIT 14SOIC; Output Current per Channel: 50mA; Number of Circuits: 4; Gain Bandwidth Product: 10MHz; Input Bias Current: 0.5pA; Slew Rate: 6.5V/µs; Operating Supply Current: 538uA; Input Offset Voltage (Vos): 300uV; Min Operating Temperature: -40°C; RoHS Compliant: Yes; Max Operating Temperature: 125°C; Mount: Surface Mount; Number of Pins: 14; Packaging: Cut Tape; Case/Package: SOIC; Number of Channels: 4
U5 = CMP-0188-01009-2: 12-Bit Quad Digital-to-Analog Converter with EEPROM Memory, 10-pin MSOP, Extended Temperature, Tape and Reel; ComponentLink3Description: Package Specification; ComponentLink3URL: http://www.microchip.com/stellent/groups/techpub_sg/documents/packagingspec/en012702.pdf; RevisionNote: URLs added. DatasheetVersion updated.; DatasheetVersion: revE, Oct-2010; ComponentLink2URL: http://ww1.microchip.com/downloads/en/DeviceDoc/22187E.pdf; ComponentLink2Description: Datasheet; PackageDescription: 10-Lead Plastic Micro Small Outline Package (UN) [MSOP]; PackageVersion: revBB, Aug-2009; ComponentLink1Description: Manufacturer URL; ComponentLink1URL: http://www.microchip.com/; PackageReference: MSOP-UN10
U6 U8 U9 = CMP-04886-000001-1: IC I/O EXPANDER I2C 8B 16TSSOP; Manufacturer: Texas Instruments; Max Junction Temp: 100°C; Interface: I2C,SMBus; Standoff Height: 0.05mm; Nominal Supply Current: 5-22uA; Number Of I/Os: 8; Max Supply Voltage: 5.5V; Min Supply Voltage: 1.65V; Frequency: 400kHz; Device Class L3: I/O Expanders; Octopart: https://octopart.com/tca9534apwr-texas+instruments-50333529; ComponentLink2URL: http://www.ti.com/lit/ds/symlink/tca9534a.pdf; ComponentLink2Description: Datasheet; Ambient Temperature Range Low: -40°C; Manufacturer Part Number: TCA9534APWR; Lead Free: Yes; Category: IC; Package: PW0016A; Automotive: No; Temperature Range Low: -40°C; Temperature Range High: +85°C; Device Class L2: Interface ICs; Temperature: -40°C to +85°C; RoHS: TRUE; Height: 1.2mm; Digikey Description: IC I/O EXPANDER I2C 8B 16TSSOP; Device Class L1: Integrated Circuits (ICs); Ambient Temperature Range High: +85°C
U7 = CMP-0704-00001-2: Triple Channel Shunt and Bus Voltage Monitor, 120 dB, 2.7 to 5.5 V, -40 to 125 degC, 16-Pin VQFN (RGV), Green (RoHS & no Sb/Br), Tape and Reel; Manufacturer: Texas Instruments; Rating: Catalog; Quiescent Current (Typ): 350 uA; Gain Error (max): 0.25%; CMR (Typ): 120 dB; Offset Voltage (max): +/- 80 uV; Gain: 1 V/V; Voltage Input Range (Bus): 0 to 26 V; ComponentLink2Description: Datasheet; PackageDescription: 16-Pin Quad Flat No-lead Package, Body 4 x 4 mm, Pitch 0.65 mm; ComponentLink3URL: http://www.ti.com/lit/ds/symlink/ina3221.pdf; PartNumber: INA3221AIRGVR; Operating Supply Range: 2.7 to 5.5 V; DatasheetVersion: SBOS576A; Temperature Range: -40 to 125 degC; ComponentLink1Description: Manufacturer URL; ComponentLink1URL: http://www.ti.com/; RoHS: TRUE; ComponentLink3Description: Package Specification; Packing: Tape and Reel; Mounting Technology: Surface Mount; ComponentLink2URL: http://www.ti.com/lit/ds/symlink/ina3221.pdf; PackageVersion: SBOS576A; PackageReference: RGV0016A
U10 = CMP-0394-00364-2: Single Output High PSRR LDO, 200 mA, Fixed 3.3 V Output, 2.7 to 5.5 V Input, 5-pin SOT-23 (DBV), -40 to 85 degC, Green (RoHS & no Sb/Br); Manufacturer: Texas Instruments; Iout(Max)(A): 0.2; Rating: Catalog; Vin(Min)(V): 2.7; Vdo(Typ)(mV): 102; Fixed Output Options(V): 3.3; Accuracy(%): 2; SubFamily: Single Channel LDO; Vin(Max)(V): 5.5; ComponentLink1URL: http://www.ti.com/; ComponentLink2URL: http://www.ti.com/general/docs/lit/getliterature.tsp?genericPartNumber=TPS79333&fileType=pdf; ComponentLink1Description: Manufacturer URL; PackageDescription: 5-Pin Plastic Small Outline, Body 1.60 Ãƒâ€” 2.90 mm, Pitch 0.95 mm; ComponentLink3URL: http://www.ti.com/litv/pdf/mpds018i; ComponentLink2Description: Datasheet; Mounting Technology: Surface Mount; ComponentLink3Description: Package Specification; PackageReference: DBV0005A; Code_JEDEC: MO-178; PartNumber: TPS79333DBVR; Vout Adj(Min)(V): 3.3; DatasheetVersion: SLVS348K; Eco-Plan: Green (RoHS & no Sb/Br); PackageVersion: 4073253-4/K; Vout Adj(Max)(V): 3.3; Iq(Typ)(mA): 0.2
U?#1 = CMP-0188-00760-3: IC DAC 12BIT V-OUT SOT23-6; Number of Outputs: 1; Supply Type: Single; Integral Nonlinearity (INL): 14.5LSB; Polarity: Unipolar; Number of Bits: 12; Min Supply Voltage: 2.7V; Output Type: Voltage; Settling Time: 6us; Max Supply Voltage: 5.5V; Nominal Supply Current: 210uA; Resolution: 12b; Interface: I2C; Input Offset Voltage (Vos): 1.1mV; Radiation Hardening: No; Number of DAC Channels: 1; Length: 3.1mm; Number of D/A Converters: 1; Number of Pins: 6; Case/Package: SOT-23-6; Lead Free: Lead Free; Number of Channels: 1; Termination: SMD/SMT; Width: 1.8mm; Contact Plating: Tin; Package Quantity: 3000; Max Operating Temperature: 125°C; Min Operating Temperature: -40°C; REACH SVHC: No SVHC; Mount: Surface Mount; Height: 1.3mm; Packaging: Tape and Reel; Number of Converters: 1
U?#2 = CMP-04895-000218-1: IC CMOS 1 CIRCUIT SOT23-5; Gain Bandwidth Product: 10MHz; Operating Supply Current: 538uA; Output Current per Channel: 50mA; Number of Circuits: 1; Input Bias Current: 0.5pA; Input Offset Voltage (Vos): 300uV; Slew Rate: 6.5V/µs; Min Operating Temperature: -40°C; Packaging: Cut Tape; RoHS Compliant: Yes; Mount: Surface Mount; Max Operating Temperature: 125°C; Case/Package: SOT-23-6

## Sheet PA-HF_100W.SchDoc
size A4; SheetNumber: 2; SheetTotal: 5
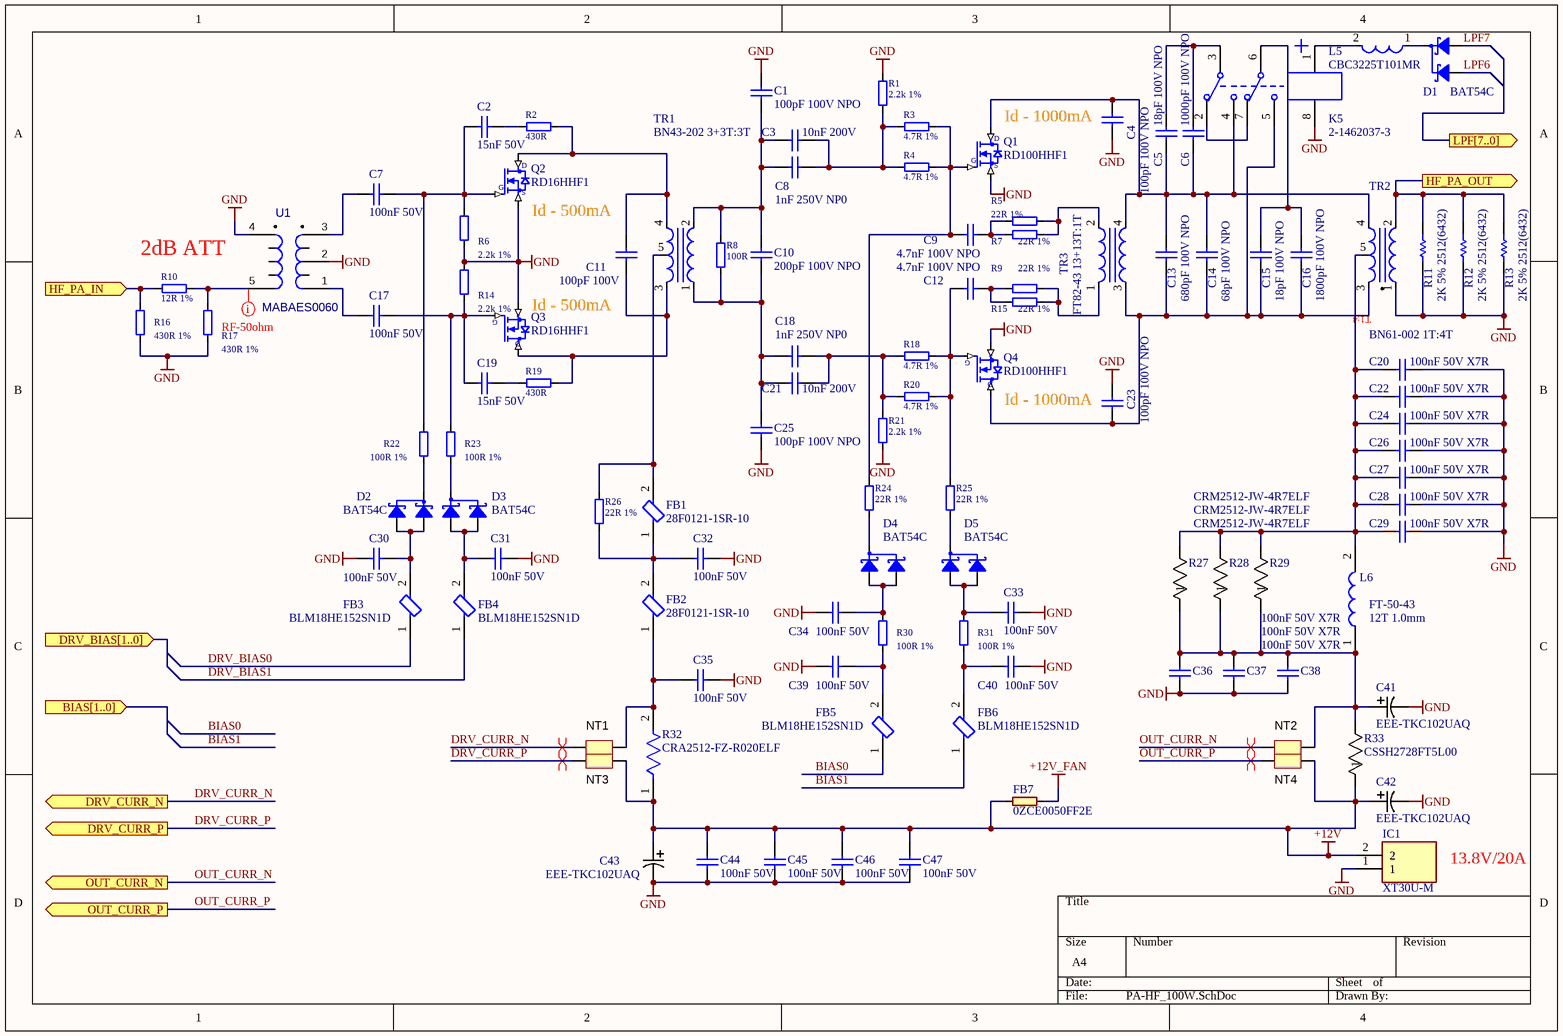
[diagram p2: PA-HF_100W.SchDoc]

### Parts
C1  100pF 100V NPO  [C-1206]
C2  15nF 50V  [C-0805]
C3  10nF 200V  [C-1206]
C4  100pF 100V NPO  [C-1206]
C5  18pF 100V NPO  [C-1206]
C6  1000pF 100V NPO  [C-1206]
C7  100nF 50V  [C-0805]
C8  1nF 250V NP0  [C-1206]
C9  4.7nF 100V NPO  [C-1206]
C10  200pF 100V NPO  [C-1206]
C11  100pF 100V  [C-0805]
C12  4.7nF 100V NPO  [C-1206]
C13  680pF 100V NPO  [C-1206]
C14  68pF 100V NPO  [C-1206]
C15  18pF 100V NPO  [C-1206]
C16  1800pF 100V NPO  [C-1206]
C17  100nF 50V  [C-0805]
C18  1nF 250V NP0  [C-1206]
C19  15nF 50V  [C-0805]
C20  100nF 50V X7R  [C-1206]
C21  10nF 200V  [C-1206]
C22  100nF 50V X7R  [C-1206]
C23  100pF 100V NPO  [C-1206]
C24  100nF 50V X7R  [C-1206]
C25  100pF 100V NPO  [C-1206]
C26  100nF 50V X7R  [C-1206]
C27  100nF 50V X7R  [C-1206]
C28  100nF 50V X7R  [C-1206]
C29  100nF 50V X7R  [C-1206]
C30  100nF 50V  [C-0805]
C31  100nF 50V  [C-0805]
C32  100nF 50V  [C-0805]
C33  100nF 50V  [C-0805]
C34  100nF 50V  [C-0805]
C35  100nF 50V  [C-0805]
C36  100nF 50V X7R  [C-1206]
C37  100nF 50V X7R  [C-1206]
C38  100nF 50V X7R  [C-1206]
C39  100nF 50V  [C-0805]
C40  100nF 50V  [C-0805]
C41  EEE-TKC102UAQ  [CAP_PAN_EEE_H13_PAN]
C42  EEE-TKC102UAQ  [CAP_PAN_EEE_H13_PAN]
C43  EEE-TKC102UAQ  [CAP_PAN_EEE_H13_PAN]
C44  100nF 50V  [C-0805]
C45  100nF 50V  [C-0805]
C46  100nF 50V  [C-0805]
C47  100nF 50V  [C-0805]
D1  BAT54C  [SOT-23]
D2  BAT54C  [SOT-23]
D3  BAT54C  [SOT-23]
D4  BAT54C  [SOT-23]
D5  BAT54C  [SOT-23]
FB1  28F0121-1SR-10  [FP-28F0121-1SR-10-MFG]
FB2  28F0121-1SR-10  [FP-28F0121-1SR-10-MFG]
FB3  BLM18HE152SN1D  [FP-BLM18-0_15-t0_8-IPC_C]
FB4  BLM18HE152SN1D  [FP-BLM18-0_15-t0_8-IPC_C]
FB5  BLM18HE152SN1D  [FP-BLM18-0_15-t0_8-IPC_C]
FB6  BLM18HE152SN1D  [FP-BLM18-0_15-t0_8-IPC_C]
FB7  0ZCE0050FF2E  [C-0805]
IC1  XT30U-M  [XT30UM]
K5  2-1462037-3  [TECO-2-1462037-3_V]
L5  CBC3225T101MR  [FP-CB3225-MFG]
L6  FT-50-43  value 12T 1.0mm  [Amidon_FT50_43]
NT1  Net-Tie  [Net-Tie_10mil]  (value not drawn)  (net tie, no BOM)
NT2  Net-Tie  [Net-Tie_10mil]  (value not drawn)  (net tie, no BOM)
NT3  Net-Tie  [Net-Tie_10mil]  (value not drawn)  (net tie, no BOM)
NT4  Net-Tie  [Net-Tie_10mil]  (value not drawn)  (net tie, no BOM)
Q1  RD100HHF1  [RD100HHF1]
Q2  RD16HHF1  [RD16HHF1]
Q3  RD16HHF1  [RD16HHF1]
Q4  RD100HHF1  [RD100HHF1]
R1  2.2k 1%  [R-1206]
R2  430R  [R-1206]
R3  4.7R 1%  [R-1206]
R4  4.7R 1%  [R-1206]
R5  22R 1%  [R-1206]
R6  2.2k 1%  [R-0805]
R7  22R 1%  [R-1206]
R8  100R  [R-1206]
R9  22R 1%  [R-1206]
R10  12R 1%  [R-0805]
R11  2K 5% 2512(6432)  [RESC2512(6432)_N]
R12  2K 5% 2512(6432)  [RESC2512(6432)_N]
R13  2K 5% 2512(6432)  [RESC2512(6432)_N]
R14  2.2k 1%  [R-0805]
R15  22R 1%  [R-1206]
R16  430R 1%  [R-0805]
R17  430R 1%  [R-0805]
R18  4.7R 1%  [R-1206]
R19  430R  [R-1206]
R20  4.7R 1%  [R-1206]
R21  2.2k 1%  [R-1206]
R22  100R 1%  [R-0805]
R23  100R 1%  [R-0805]
R24  22R 1%  [R-1206]
R25  22R 1%  [R-1206]
R26  22R 1%  [R-1206]
R27  CRM2512-JW-4R7ELF  [BO_CR2512]
R28  CRM2512-JW-4R7ELF  [BO_CR2512]
R29  CRM2512-JW-4R7ELF  [BO_CR2512]
R30  100R 1%  [R-0805]
R31  100R 1%  [R-0805]
R32  CRA2512-FZ-R020ELF  [FP-CRA2512-IPC_C]
R33  CSSH2728FT5L00  [STA_CSSH2728_STP]
TR1  BN43-202 3+3T:3T  [BN43-202]
TR2  BN61-002 1T:4T  [BN61-002]
TR3  FT82-43 13+13T:1T  [Amidon_FT82-43]
U1  MABAES0060  [TRANSF_ACORE2]

### Ports
BIAS[1..0] (in), DRV_BIAS[1..0] (in), DRV_CURR_N (out), DRV_CURR_P (out), HF_PA_IN (in), HF_PA_OUT (out), LPF[7..0] (out), OUT_CURR_N (out), OUT_CURR_P (out)

### Nets
+12V: C42.1 C43.1 C44.2 C45.2 C46.2 C47.2 FB7.1 IC1.2 NT3.2 NT4.2 R32.1 R33.1
+12V_FAN: FB7.2
GND: C1.1 C4.2 C20.1 C22.1 C23.1 C24.1 C25.2 C26.1 C27.1 C28.1 C29.1 C30.2 C31.1 C32.1 C33.1 C34.1 C35.1 C36.1 C37.1 C38.1 C39.1 C40.1 C41.2 C42.2 C43.2 C44.1 C45.1 C46.1 C47.1 IC1.1 K5.8 Q1.1(S) Q2.1(S) Q3.1(S) Q4.1(S) R1.2 R6.1 R11.1 R12.1 R13.1 R14.2 R16.1 R17.1 R21.2 TR2.1 U1.2(S2) U1.4(P1)
BIAS0: FB5.1
BIAS1: FB6.1
DRV_BIAS0: FB3.1
DRV_BIAS1: FB4.1
DRV_CURR_N: NT1.1 ; port DRV_CURR_N
DRV_CURR_P: NT3.1 ; port DRV_CURR_P
LPF6: D1.2
LPF7: D1.1
OUT_CURR_N: NT2.1 ; port OUT_CURR_N
OUT_CURR_P: NT4.1 ; port OUT_CURR_P
NetC1_2: C1.2 C3.1 C8.1 C10.1 R8.2 TR1.2
NetC2_1: C2.1 C7.2 Q2.2 R6.2 R22.2
NetC2_2: C2.2 R2.1
NetC3_2: C3.2 C8.2 R1.1 R3.1 R4.1
NetC4_1: C4.1 C5.1 C6.1 C13.1 C14.1 K5.4 Q1.3(D) TR2.4 TR3.4
NetC5_2: C5.2 C6.2 K5.3
NetC7_1: C7.1 U1.3(S1)
NetC9_1: C9.1 Q1.2 R3.2 R4.2 R24.2
NetC9_2: C9.2 R5.1 R7.1
NetC10_2: C10.2 C18.1 C21.1 C25.1 R8.1 TR1.1
NetC11_1: C11.1 Q3.3(D) R19.2 TR1.3
NetC11_2: C11.2 Q2.3(D) R2.2 TR1.4
NetC12_1: C12.1 Q4.2 R18.2 R20.2 R25.2
NetC12_2: C12.2 R9.1 R15.1
NetC13_2: C13.2 C14.2 C15.1 C16.2 C23.2 K5.5 Q4.3(D) TR2.3 TR3.3
NetC15_2: C15.2 C16.1 K5.6
NetC17_1: C17.1 U1.1(S3)
NetC17_2: C17.2 C19.1 Q3.2 R14.1 R23.2
NetC18_2: C18.2 C21.2 R18.1 R20.1 R21.1
NetC19_2: C19.2 R19.1
NetC20_2: C20.2 C22.2 C24.2 C26.2 C27.2 C28.2 C29.2 L6.2 R27.2 R28.2 R29.2 TR2.5
NetC30_1: C30.1 D2.1 D2.2 FB3.2
NetC31_2: C31.2 D3.1 D3.2 FB4.2
NetC32_2: C32.2 FB1.1 FB2.2 R26.1
NetC33_2: C33.2 D5.1 D5.2 R31.2
NetC34_2: C34.2 D4.1 D4.2 R30.2
NetC35_2: C35.2 FB2.1 NT1.2 R32.2
NetC36_2: C36.2 C37.2 C38.2 C41.1 L6.1 NT2.2 R27.1 R28.1 R29.1 R33.2
NetC39_2: C39.2 FB5.2 R30.1
NetC40_2: C40.2 FB6.2 R31.1
NetD1_3: D1.3 L5.1
NetD2_3: D2.3 R22.1
NetD3_3: D3.3 R23.1
NetD4_3: D4.3 R24.1
NetD5_3: D5.3 R25.1
NetFB1_2: FB1.2 R26.2 TR1.5
NetK4_2: R10.1 R16.2 ; port HF_PA_IN
NetK5_1: K5.1 L5.2
NetK5_2: K5.2 K5.7
NetK6_4: R11.2 R12.2 R13.2 TR2.2 ; port HF_PA_OUT
NetR5_2: R5.2 R7.2 TR3.2
NetR9_2: R9.2 R15.2 TR3.1
NetR10_2: R10.2 R17.2 U1.5(P2)

### Layout directives
differential pair: DRV_CURR_N, DRV_CURR_P, OUT_CURR_N, OUT_CURR_P
rule Width Constraint [Pref Impedance = 50,00ohms    Min Impedance = 50,00ohms    Max Impedance = 50,00ohms]: NetR10_2

### Notes on the sheet
- Id - 1000mA
- (near Q2) Id - 500mA
- (near R10) 2dB ATT
- (near Q3) Id - 500mA
- 13.8V/20A
- (in symbol BN61-002 1T:4T) T1:4
- (in symbol RD16HHF1) G
- (in symbol RD100HHF1) G

### Library data of the parts
C1-C19 C21 C23 C25 C30-C35 C39 C40 C44-C47 = C semi: Ceramic Multilayer Capacitor
C20 C22 C24 C26-C29 C36-C38 = C semi: Ceramic Multilayer Capacitor; Manufacturer P/N: C1206C104K5RAC7867
C41-C43 = EEE-TKC102UAQ: No Description Available; Mfr_Name: Panasonic; Type: DEV; Copyright: Copyright (C) 2022 Ultra Librarian. All rights reserved.; Manufacturer_Part_Number: EEE-TKC102UAQ; RefDes: RefDes
D1-D5 = D SH SOT23C: Schottky barrier diodes; Manufacturer: NXP; TypeNum: 435; Parameters: VR 30V, IF 200mA; Note: *; Link: *; Manufacturer P/N: BAT54C
FB1 FB2 = CMP-19111-000017-1: FERRITE BEAD 96 OHM 2SMD 1LN; Current Rating: 10A; Frequency: 100MHz; DC Resistance (DCR): 1mR; Impedance: 96R; Number of Lines: 1; Depth: 3.05mm; Width: 0.12inch; Min Operating Temperature: -40°C; Series: 28; Lead Free: Lead Free; Max DC Current: 10A; Case/Package: SMD/SMT; Termination: SMD/SMT; Max Operating Temperature: 125°C; Mount: Surface Mount; Case Code (Imperial): 3312; Material: Ferrite; Case Code (Metric): 8531; Packaging: Tape and Reel; Length: 0.335inch; RoHS Compliant: Yes; Test Frequency: 100MHz; Weight: 0.01056oz; Max Current Rating: 10A; Height: 0.12inch; Contact Plating: Tin; Package Quantity: 1
FB3-FB6 = CMP-0686-00368-3: as FB8 on sheet PA-CONTROL; Test Frequency: 100MHz; Case/Package: 0603; Max Operating Temperature: 125°C; Package Quantity: 1; Max DC Current: 500mA; Tolerance: 25%; Core Material: Ferrite; Width: 0.8mm; Number of Pins: 2; Depth: 0.8mm; Radiation Hardening: No; Case Code (Imperial): 0603; Min Operating Temperature: -55°C; Termination: SMD/SMT; Material: Ferrite; Military Standard: Not; Number of Lines: 1; DC Current: 500mA; Length: 1.6mm; REACH SVHC: No SVHC; Lead Free: Lead Free; Current Rating: 500mA; Max Current Rating: 500mA; Packaging: Tape and Reel; Case Code (Metric): 1608; Height: 0.8mm
FB7 = L BEAD SMD: Chip Ferrite Bead; Manufacturer: KING CORE; Manufacturer P/N: FBM-11-160808-470T; numsch: 031; TypeNum: 315; Parameters: Z=47 ±25%, 300mA; Current: *
IC1 = XT30U-M: Integrated Circuit; Manufacturer_Name: Amass; Datasheet Link: https://www.tme.eu/Document/3cbfa5cfa544d79584972dd5234a409e/XT30U%20SPEC.pdf; Height: 10.7mm; Manufacturer_Part_Number: XT30U-M
K5 = CMP-2000-05409-1: as K1 on sheet PA-HF_100W-VHF_60W; Contact Material: PalladiumRuthenium/Gold; Pin Count: 8; LED Indicator: No; Operating Temp Range: -40Cto85C; Push To Test Button: No; Mounting Style: SurfaceMount; Type: SignalRelay; Packaging: TapeandReel; Datasheet Version: Rev. 0116, 01/2016; Manufacturer URL: http://www.te.com/; Datasheet URL: http://www.te.com/commerce/DocumentDelivery/DDEController?Action=srchrtrv&DocNm=108-98001&DocType=SS&DocLang=EN; Termination Style: GullWing
L5 = CMP-14484-000373-1: as L1 on sheet PA-HF_100W-VHF_60W; Max Operating Temperature: 105°C; Length: 0.126inch; Inductance: 100uH; Current Rating: 340mA; Resistor Type: Wirewound; Halogen Free: Halogen Free; Height - Seated (Max): 0.106inch; Case/Package: 1210; Package Quantity: 1000; Lead Free: Lead Free; Series: CB; Tolerance: 20%; Depth: 2.7mm; Number of Pins: 2; Width: 0.098inch; Termination: SMD/SMT; Min Operating Temperature: -40°C; Max DC Current: 340mA; Inductance Tolerance: 20%; Radiation Hardening: No; Military Standard: Not; Height: 2.5mm; Case Code (Metric): 3225; Packaging: Tape and Reel; Mount: Surface Mount; RoHS Compliant: Yes; Case Code (Imperial): 1210
L6 = Amidon
NT1-NT4 = Net-Tie: Single point connection between nets.; SymbolCreator: codlsc; SymbolVersion: 2009-07-01; MountType: SMT; PackageReference: N/A; Publisher: Texas Instruments; LatestRevisionDate: 2014-12-30; LatestRevisionNote: Added Alternate PartNumber and Alternate Manufacturer parameters to appropriate components.
R1-R10 R14-R25 R30 R31 = RES semi: Chip Resistor; Power: *; TCR: *; Series: *; Tolerance: *
R11-R13 = CMP-1018-00105-1: 2K 1W 5% 2512 (6432 Metric)  SMD; Case-Metric: 6432; Case-EIA: 2512; Value: 2000.00 Ohm; Power: 1 W; Technology: SMT; Tolerance: 5 %
R26 = RES semi: Chip Resistor; Manufacturer P/N: RC1206FR-0722RL; Power: *; TCR: *; Series: *; Tolerance: *
R27-R29 = CRM2512-JW-4R7ELF: No Description Available; Mfr_Name: Bourns Electronics; Copyright: Copyright (C) 2022 Ultra Librarian. All rights reserved.; Manufacturer_Part_Number: CRM2512-JW-4R7ELF; RefDes: RefDes; Type: DEV
R32 = CMP-07231-006693-1: RES 0.02 OHM 1% 3W 2512
R33 = CSSH2728FT5L00: No Description Available; Mfr_Name: Stackpole International; Copyright: Copyright (C) 2022 Ultra Librarian. All rights reserved.; Manufacturer_Part_Number: CSSH2728FT5L00; RefDes: RefDes; Type: DEV
TR1 = BN43-202 3+3T:3T: BN43-202 3+3T:3T 0.5mm
TR2 = BN61-002 1T:4T: BN61-002 1T:4T 25ohms coaxial
TR3 = FT82-43 13+13T:1T: BN43-202 3+3T:3T 0.5mm
U1 = MABAES0060: 1:1; Value: *